# EAGLE schematic board3 (EAGLE 7.7.0)
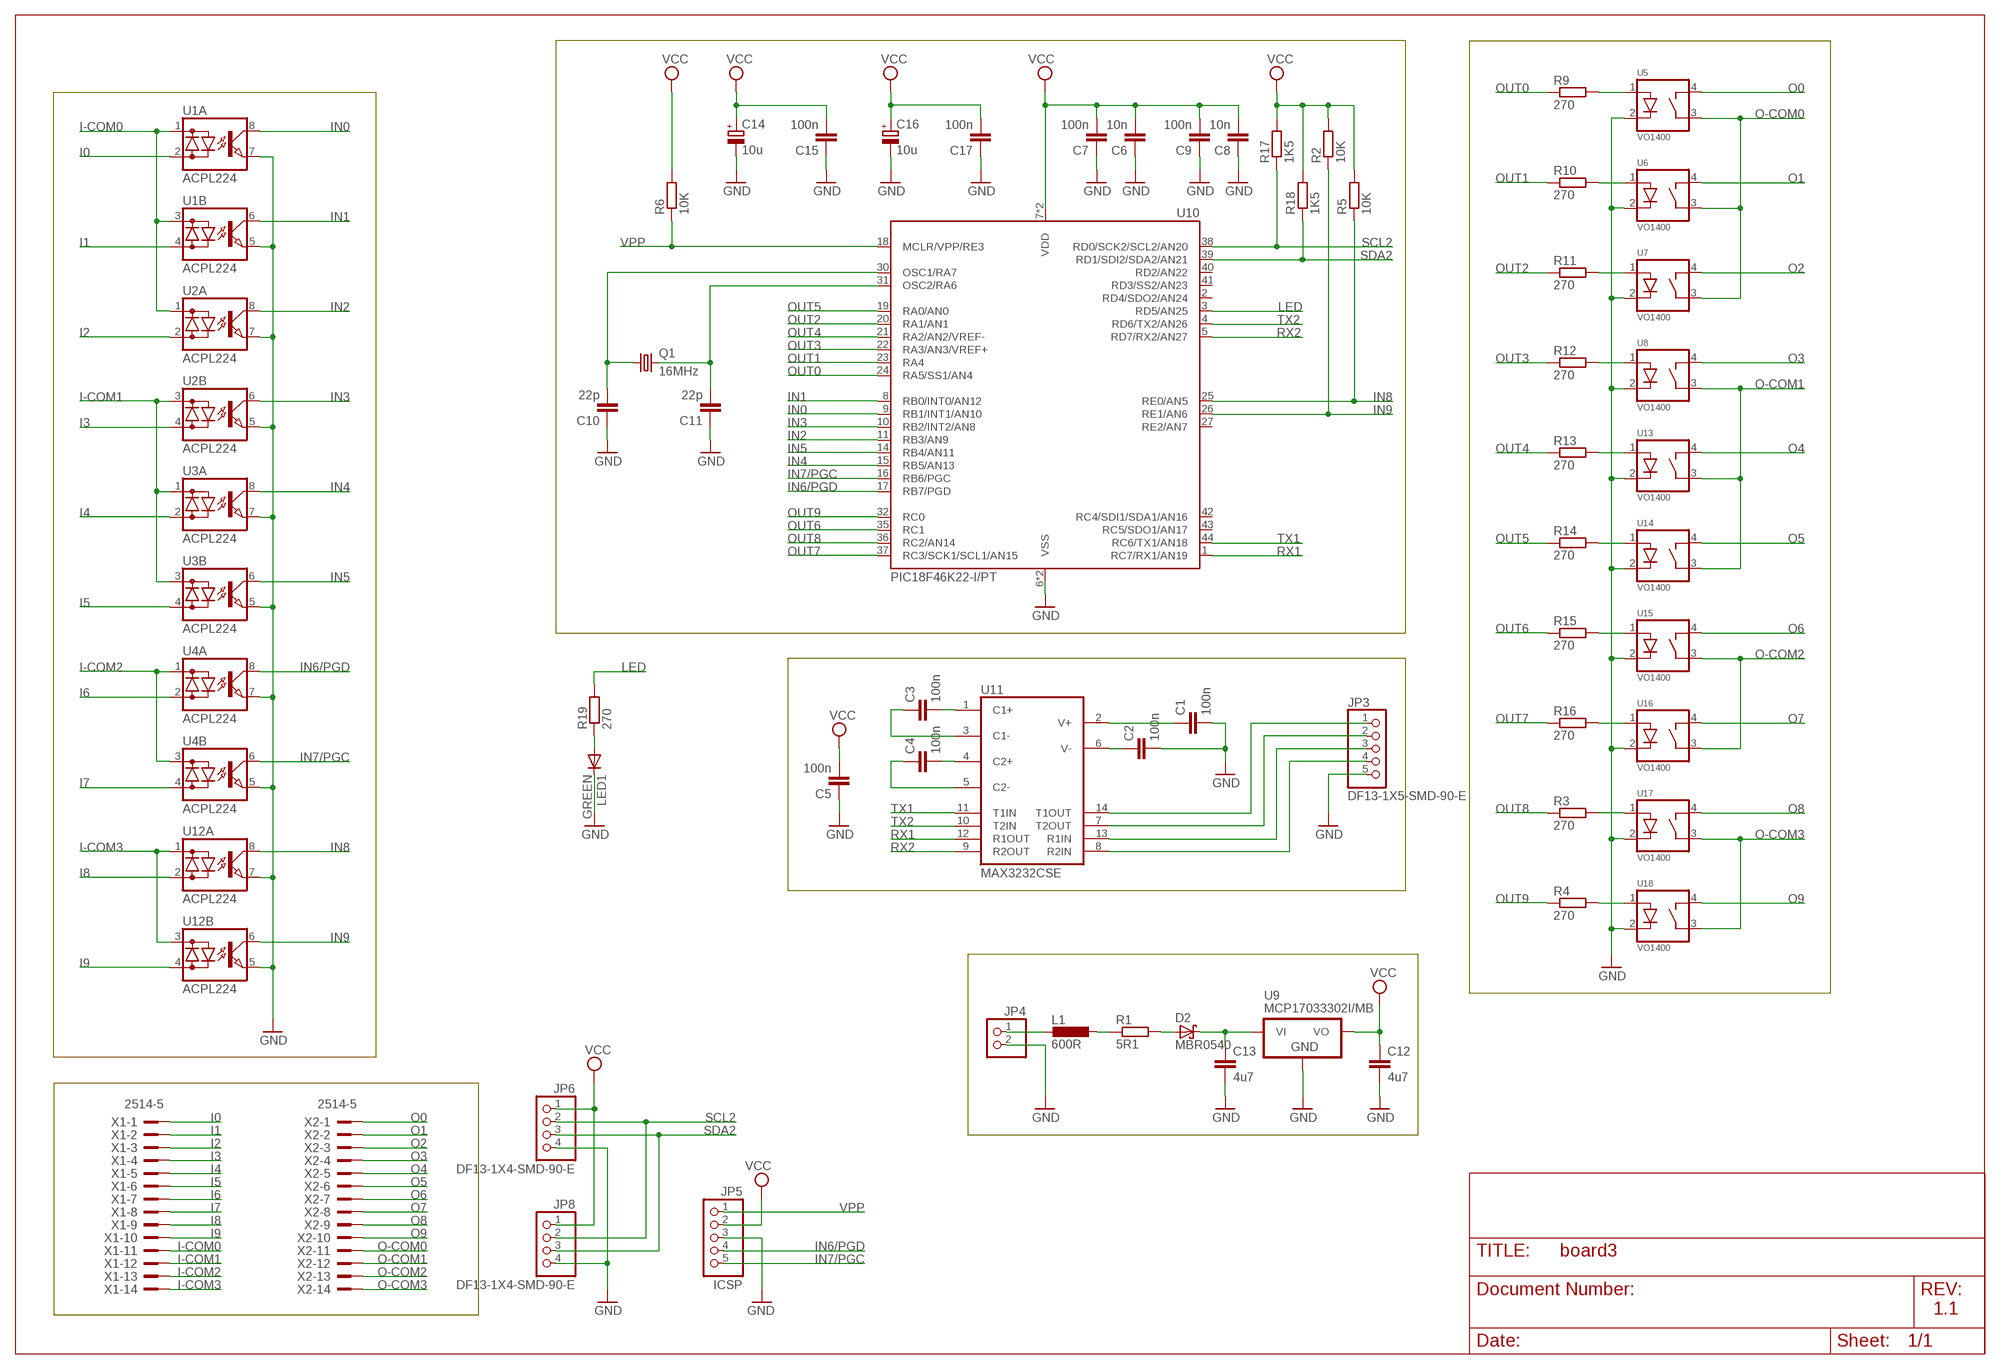
[diagram p0: schematic, sheet 1]

## Parts
C1  100n  C-EUC0805  [C0805]
C2  100n  C-EUC0805  [C0805]
C3  100n  C-EUC0805  [C0805]
C4  100n  C-EUC0805  [C0805]
C5  100n  C-EUC0805  [C0805]
C6  10n  C-EUC0805  [C0805]
C7  100n  C-EUC0805  [C0805]
C8  10n  C-EUC0805  [C0805]
C9  100n  C-EUC0805  [C0805]
C10  22p  C-EUC0805  [C0805]
C11  22p  C-EUC0805  [C0805]
C12  4u7  C-EUC0805  [C0805]
C13  4u7  C-EUC0805  [C0805]
C14  10u  CPOL-EUSMCA  [SMC_A]
C15  100n  C-EUC0805  [C0805]
C16  10u  CPOL-EUSMCA  [SMC_A]
C17  100n  C-EUC0805  [C0805]
D2  MBR0540  SMF5.0AT1  [SOD123FL]
JP3  DF13-1X5-SMD-90-E  [1X5-SMD-90-E]
JP4  PINHD-1X2/90  [1X02/90]
JP5  ICSP  PINHD-1X5-2MM  [1X05-2MM]
JP6  DF13-1X4-SMD-90-E  [1X4-SMD-90-E]
JP8  DF13-1X4-SMD-90-E  [1X4-SMD-90-E]
L1  600R  L-0805  [L-0805]
LED1  GREEN  D-LED-0805  [D-LED-0805]
Q1  16MHz  CRYSTALSM49  [SM49]
R1  5R1  R-EU_R0805  [R0805]
R2  10K  R-EU_R0805  [R0805]
R3  270  R-EU_R0805  [R0805]
R4  270  R-EU_R0805  [R0805]
R5  10K  R-EU_R0805  [R0805]
R6  10K  R-EU_R0805  [R0805]
R9  270  R-EU_R0805  [R0805]
R10  270  R-EU_R0805  [R0805]
R11  270  R-EU_R0805  [R0805]
R12  270  R-EU_R0805  [R0805]
R13  270  R-EU_R0805  [R0805]
R14  270  R-EU_R0805  [R0805]
R15  270  R-EU_R0805  [R0805]
R16  270  R-EU_R0805  [R0805]
R17  1K5  R-EU_R0805  [R0805]
R18  1K5  R-EU_R0805  [R0805]
R19  270  R-EU_R0805  [R0805]
U1  ACPL224  [SO08]
U2  ACPL224  [SO08]
U3  ACPL224  [SO08]
U4  ACPL224  [SO08]
U5  VO1400  [SOP04]
U6  VO1400  [SOP04]
U7  VO1400  [SOP04]
U8  VO1400  [SOP04]
U9  MCP17033302I/MB  [SOT89]
U10  PIC18F46K22-I/PT  [TQFP44]
U11  MAX3232CSE  [SO16]
U12  ACPL224  [SO08]
U13  VO1400  [SOP04]
U14  VO1400  [SOP04]
U15  VO1400  [SOP04]
U16  VO1400  [SOP04]
U17  VO1400  [SOP04]
U18  VO1400  [SOP04]
X1  2514-5  [PAK100/2500-5-14]
X2  2514-5  [PAK100/2500-5-14]

## Nets
GND [GND]: C1.2 C2.2 C5.1 C6.1 C7.1 C8.1 C9.1 C10.1 C11.1 C12.2 C13.2 C14.- C15.1 C16.- C17.1 JP3.5 JP4.2 JP5.3 JP6.4 JP8.4 LED1.C U1.5(B:E) U1.7(A:E) U2.5(B:E) U2.7(A:E) U3.5(B:E) U3.7(A:E) U4.5(B:E) U4.7(A:E) U5.2(K) U6.2(K) U7.2(K) U8.2(K) U9.1(GND) U10.6(VSS) U10.29(VSS) U12.5(B:E) U12.7(A:E) U13.2(K) U14.2(K) U15.2(K) U16.2(K) U17.2(K) U18.2(K)
I0 [INP]: U1.2(A:AC2) X1.1
I1 [INP]: U1.4(B:AC2) X1.2
I2 [INP]: U2.2(A:AC2) X1.3
I3 [INP]: U2.4(B:AC2) X1.4
I4 [INP]: U3.2(A:AC2) X1.5
I5 [INP]: U3.4(B:AC2) X1.6
I6 [INP]: U4.2(A:AC2) X1.7
I7 [INP]: U4.4(B:AC2) X1.8
I8 [INP]: U12.2(A:AC2) X1.9
I9 [INP]: U12.4(B:AC2) X1.10
I-COM0 [COMI]: U1.1(A:AC1) U1.3(B:AC1) U2.1(A:AC1) X1.11
I-COM1 [COMI]: U2.3(B:AC1) U3.1(A:AC1) U3.3(B:AC1) X1.12
I-COM2 [COMI]: U4.1(A:AC1) U4.3(B:AC1) X1.13
I-COM3 [COMI]: U12.1(A:AC1) U12.3(B:AC1) X1.14
IN0: U1.8(A:C) U10.9(RB1/INT1/AN10)
IN1: U1.6(B:C) U10.8(RB0/INT0/AN12)
IN2: U2.8(A:C) U10.11(RB3/AN9)
IN3: U2.6(B:C) U10.10(RB2/INT2/AN8)
IN4: U3.8(A:C) U10.15(RB5/AN13)
IN5: U3.6(B:C) U10.14(RB4/AN11)
IN6/PGD: JP5.4 U4.8(A:C) U10.17(RB7/PGD)
IN7/PGC: JP5.5 U4.6(B:C) U10.16(RB6/PGC)
IN8: R5.1 U10.25(RE0/AN5) U12.8(A:C)
IN9: R2.1 U10.26(RE1/AN6) U12.6(B:C)
LED: R19.2 U10.3(RD5/AN25)
N$1: R3.2 U17.1(A)
N$2 [V24]: JP4.1 L1.2
N$3 [V24]: L1.1 R1.1
N$4: JP3.1 U11.14(T1OUT)
N$5 [V24]: C13.1 D2.C U9.2(VI) U9.2@1(VI)
N$6: R4.2 U18.1(A)
N$7 [V24]: D2.A R1.2
N$8: C10.2 Q1.1 U10.30(OSC1/RA7)
N$13: JP3.2 U11.7(T2OUT)
N$14: JP3.3 U11.13(R1IN)
N$15: JP3.4 U11.8(R2IN)
N$16: C3.2 U11.1(C1+)
N$17: R9.2 U5.1(A)
N$18: R10.2 U6.1(A)
N$22: LED1.A R19.1
N$25: R11.2 U7.1(A)
N$26: R12.2 U8.1(A)
N$29: C3.1 U11.3(C1-)
N$30: C4.2 U11.4(C2+)
N$33: C4.1 U11.5(C2-)
N$34: C1.1 U11.2(V+)
N$35: C2.1 U11.6(V-)
N$36: C11.2 Q1.2 U10.31(OSC2/RA6)
N$51: R15.2 U15.1(A)
N$52: R13.2 U13.1(A)
N$53: R14.2 U14.1(A)
N$54: R16.2 U16.1(A)
O0 [OUT]: U5.4(O1) X2.1
O1 [OUT]: U6.4(O1) X2.2
O2 [OUT]: U7.4(O1) X2.3
O3 [OUT]: U8.4(O1) X2.4
O4 [OUT]: U13.4(O1) X2.5
O5 [OUT]: U14.4(O1) X2.6
O6 [OUT]: U15.4(O1) X2.7
O7 [OUT]: U16.4(O1) X2.8
O8 [OUT]: U17.4(O1) X2.9
O9 [OUT]: U18.4(O1) X2.10
O-COM0 [COMO]: U5.3(O2) U6.3(O2) U7.3(O2) X2.11
O-COM1 [COMO]: U8.3(O2) U13.3(O2) U14.3(O2) X2.12
O-COM2 [COMO]: U15.3(O2) U16.3(O2) X2.13
O-COM3 [COMO]: U17.3(O2) U18.3(O2) X2.14
OUT0: R9.1 U10.24(RA5/SS1/AN4)
OUT1: R10.1 U10.23(RA4)
OUT2: R11.1 U10.20(RA1/AN1)
OUT3: R12.1 U10.22(RA3/AN3/VREF+)
OUT4: R13.1 U10.21(RA2/AN2/VREF-)
OUT5: R14.1 U10.19(RA0/AN0)
OUT6: R15.1 U10.35(RC1)
OUT7: R16.1 U10.37(RC3/SCK1/SCL1/AN15)
OUT8: R3.1 U10.36(RC2/AN14)
OUT9: R4.1 U10.32(RC0)
RX1: U10.1(RC7/RX1/AN19) U11.12(R1OUT)
RX2: U10.5(RD7/RX2/AN27) U11.9(R2OUT)
SCL2: JP6.2 JP8.2 R17.1 U10.38(RD0/SCK2/SCL2/AN20)
SDA2: JP6.3 JP8.3 R18.1 U10.39(RD1/SDI2/SDA2/AN21)
TX1: U10.44(RC6/TX1/AN18) U11.11(T1IN)
TX2: U10.4(RD6/TX2/AN26) U11.10(T2IN)
VCC [VCC]: C5.2 C6.2 C7.2 C8.2 C9.2 C12.1 C14.+ C15.2 C16.+ C17.2 JP5.2 JP6.1 JP8.1 R2.2 R5.2 R6.2 R17.2 R18.2 U9.3(VO) U10.7(VDD) U10.28(VDD)
VPP: JP5.1 R6.1 U10.18(MCLR/VPP/RE3)
Unconnected: U10.2(RD4/SDO2/AN24) U10.27(RE2/AN7) U10.40(RD2/AN22) U10.41(RD3/SS2/AN23) U10.42(RC4/SDI1/SDA1/AN16) U10.43(RC5/SDO1/AN17)

## Notes on the sheet
- 1.1

## Power pins joined to a net without a drawn wire
GND: U11.15(GND)
VCC: U11.16(VCC)

## Library data of the parts
C1-C5 C7 C9 C17 = rcl:C-EU: CAPACITOR, European symbol; C_CAPACITANCE: 100nF; C_CASE: 0805; C_DIELECTRIC: X7R; C_VOLTAGE: 25V; MANUFACTURER: Kemet; REFERENCE: C0805C104K5RACTU; TYPE: C
C6 C8 = rcl:C-EU: CAPACITOR, European symbol; C_CAPACITANCE: 10nF; C_CASE: 0805; C_DIELECTRIC: X7R; C_VOLTAGE: 25V; MANUFACTURER: Kemet; REFERENCE: C0805F103K5RACTU; TYPE: C
C10 C11 = rcl:C-EU: CAPACITOR, European symbol; C_CAPACITANCE: 22pF; C_CASE: 0805; C_DIELECTRIC: X7R; C_VOLTAGE: 25V; MANUFACTURER: AVX; REFERENCE: 08051C220JAT2A; TYPE: C
C12 C13 = rcl:C-EU: CAPACITOR, European symbol; C_CAPACITANCE: 4.7uF; C_CASE: 0805; C_DIELECTRIC: X7R; C_VOLTAGE: 25V; MANUFACTURER: Taiyo Yuden; REFERENCE: TMK212AB7475KG-T; TYPE: C
C14 C16 = rcl:CPOL-EU: POLARIZED CAPACITOR, European symbol; C_CAPACITANCE: 10uF; C_CASE: A; C_DIELECTRIC: TANT; C_VOLTAGE: 6.3V; MANUFACTURER: Vishay; REFERENCE: T55A106M6R3C0300; TYPE: C
C15 = rcl:C-EU: CAPACITOR, European symbol; C_CAPACITANCE: 100nF; C_CASE: 0805; C_DIELECTRIC: X7R; C_VOLTAGE: 25V; MENUFACTURER: Kemet; REFERENCE: C0805C104K5RACTU; TYPE: C
D2 = diode:SMF5.0AT1: 200 W Transient Voltage Suppressor Source: Data sheet <http://www.onsemi.com/pub_link/Collateral/SMF5.0AT1-D.PDF>; D_CASE: SOD123FL; MANUFACTURER: Fairchild Semiconductor; REFERENCE: MBR0540; TYPE: D
JP3 = hirose-df13:DF13-1X5: Conector Hirose DF13, 5 pin; MANUFACTURER: Hirose Electric; REFERENCE: DF13-5P-1.25H(75)
JP4 = pinhead:PINHD-1X2: PIN HEADER
JP5 = pinhead200:PINHD-1X5-2MM: Pin header 1x5 2mm pitch
JP6 JP8 = hirose-df13:DF13-1X4: Conector Hirose DF13, 4 pin; MANUFACTURER: Hirose Electric; REFERENCE: DF13-4P-1.25H(75)
L1 = smd-parts:L: Inductor; L_CASE: 0805; L_IMPEDANCE: 600R; MANUFACTURER: Vishay; REFERENCE: ILBB0805ER601V; TYPE: L
LED1 = smd-parts:D-LED: Chip led 0805; LED_CASE: 0805; MANUFACTURER: Avago; REFERENCE: HSMG-C170; TYPE: LED
Q1 = crystal:CRYSTAL: CRYSTAL; MANUFACTURER: TXC Corporation; OC_FARNELL: unknown; OC_NEWARK: unknown; REFERENCE: 9C-16.000MEEJ-T; TYPE: XTAL; XTAL_CASE: HC-49/S; XTAL_FREQUENCY: 16MHz
R1 = rcl:R-EU_: RESISTOR, European symbol; MANUFACTURER: GENERIC; REFERENCE: GPR08055R1; R_CASE: 0805; R_RESISTANCE: 5R1; R_TOLERANCE: 1%; TYPE: R
R2 R5 R6 = rcl:R-EU_: RESISTOR, European symbol; MANUFACTURER: GENERIC; REFERENCE: GPR080510K; R_CASE: 0805; R_RESISTANCE: 10K; R_TOLERANCE: 1%; TYPE: R
R3 R4 R9-R16 R19 = rcl:R-EU_: RESISTOR, European symbol; MANUFACTURER: GENERIC; REFERENCE: GPR0805270R; R_CASE: 0805; R_RESISTANCE: 270R; R_TOLERANCE: 1%; TYPE: R
R17 R18 = rcl:R-EU_: RESISTOR, European symbol; MANUFACTURER: GENERIC; REFERENCE: GPR08051K5; R_CASE: 0805; R_RESISTANCE: 1K5; R_TOLERANCE: 1%; TYPE: R
U1-U4 U12 = optoacopladores:ACPL224: Optoacoplador AC de 2 canales. Salida OC.; MANUFACTURER: Avago; REFERENCE: ACPL-224-500E; TYPE: IC
U5-U8 U13-U18 = optoacopladores:VO1400: Rele de estado solido VISHAY 60V/100mA; MANUFACTURER: Vishay; REFERENCE: VO1400AEFTR
U9 = microchip-analog:MCP1703*: Regulador de tension lineal LDO; IC_CASE: SOT89; MANUFACTURER: Microchip; REFERENCE: MCP1703T-3302E/MB; TYPE: IC
U10 = microchip-pic:PIC18F4*K22: Microcontrolador PIC18F4xK22; MANUFACTURER: Microchip; REFERENCE: PIC18F46K22T-I/PT; TYPE: IC
U11 = maxim:MAX3232*: True RS-232 Transceivers 3.0V to 5.5V, Low-Power up to 1Mbps, Using Four 0.1µF External Capacitors Source: http://pdfserv.maxim-ic.com/en/ds/MAX3222-MAX3241.pdf; MANUFACTURER: Maxim; MPN: MAX3232CSE; OC_FARNELL: 9725490; OC_NEWARK: 90C2890; TYPE: IC; _REFERENCE: MAX3232CSE
X1 X2 = con-3m:2514-: 3M (TM) Pak 100 4-Wall Header Source: 3M; MPN: N2514-5002RB; OC_FARNELL: 1788673; OC_NEWARK: 97K6709

## Net classes
0 default: width 0.2 mm
1 V24: width 0.4 mm
2 VCC: width 0.4 mm
3 GND: width 0.8 mm
4 COMI: width 0.8 mm
5 COMO: width 0.8 mm
6 INP: width 0.4 mm
7 OUT: width 0.4 mm